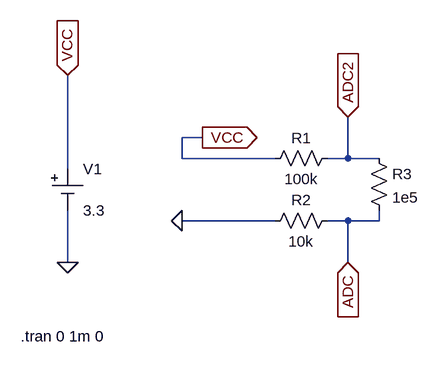
[diagram p0: schematic SoilMeasurement_v1.asc]
SoilMeasurement_v1.asc, the LTspice schematic file:
Version 4
SHEET 1 880 680
WIRE 176 -16 144 -16
WIRE 144 16 144 -16
WIRE 288 16 144 16
WIRE 400 16 400 -48
WIRE 400 16 368 16
WIRE 448 16 400 16
WIRE -32 32 -32 -112
WIRE 288 112 144 112
WIRE 400 112 368 112
WIRE 448 112 448 96
WIRE 448 112 400 112
WIRE -32 176 -32 96
WIRE 400 176 400 112
FLAG -32 176 0
FLAG -32 -112 VCC
IOPIN -32 -112 In
FLAG 176 -16 VCC
IOPIN 176 -16 Out
FLAG 144 112 0
FLAG 400 176 ADC
IOPIN 400 176 In
FLAG 400 -48 ADC2
IOPIN 400 -48 In
SYMBOL Misc\\cell -32 32 R0
WINDOW 123 0 0 Left 2
WINDOW 39 0 0 Left 2
SYMATTR InstName V1
SYMATTR Value 3.3
SYMBOL res 384 0 R90
WINDOW 0 0 56 VBottom 2
WINDOW 3 32 56 VTop 2
SYMATTR InstName R1
SYMATTR Value 100k
SYMATTR SpiceLine tol=1 pwr=0.1
SYMBOL res 384 96 R90
WINDOW 0 0 56 VBottom 2
WINDOW 3 32 56 VTop 2
SYMATTR InstName R2
SYMATTR Value 10k
SYMATTR SpiceLine tol=1 pwr=0.1
SYMBOL res 432 0 R0
SYMATTR InstName R3
SYMATTR Value 1e5
TEXT -104 290 Left 2 !.tran 0 1m 0

The netlist it stands for:
* SoilMeasurement_v1.asc
V1 VCC 0 3.3
R1 ADC2 VCC 100k tol=1 pwr=0.1
R2 ADC 0 10k tol=1 pwr=0.1
R3 ADC2 ADC 1e5
.tran 0 1m 0
.backanno
.end